# Altium project TIDA-01576_ADS8686S_ISO_Interface.PrjPcb (part 4 of 5)

## Sheet TIDA-01576_ADS8686S_ISO_Interface_Pg6-LevelShifters.SchDoc
size 431 x 279 mm; Date: Not shown in title block; ApprovedBy: Not shown in title block; CheckedBy: Not shown in title block; Author: Not shown in title block; CompanyName: Not shown in title block; Engineer: Not shown in title block; Organization: Not shown in title block; Address1: Not shown in title block; Address2: Not shown in title block; Address3: Not shown in title block; Address4: Not shown in title block; DocumentNumber: 1; Revision: Use project parameter SCH_Rev; SheetNumber: 6; SheetTotal: 8; PageSetup: Record=PageOptions|CenterHorizontal=True|CenterVertical=True|PrintScale=1.00|XCorrection=1.00|YCorrection=1.00|PrintKind=0|BorderSize=5000000|LeftOffset=0|BottomOffset=0|Orientation=2|PaperLength=1000|PaperWidth=1000|Scale=100|PaperSource=15|PrintQuality=600|MediaType=1|DitherType=10|PaperKind=Letter|PrintScaleMode=1; CurrentTime: Not shown in title block; CurrentDate: Not shown in title block; Time: Not shown in title block; DocumentFullPathAndName: Not shown in title block; DocumentName: Not shown in title block; ModifiedDate: Not shown in title block; ImagePath: Not shown in title block
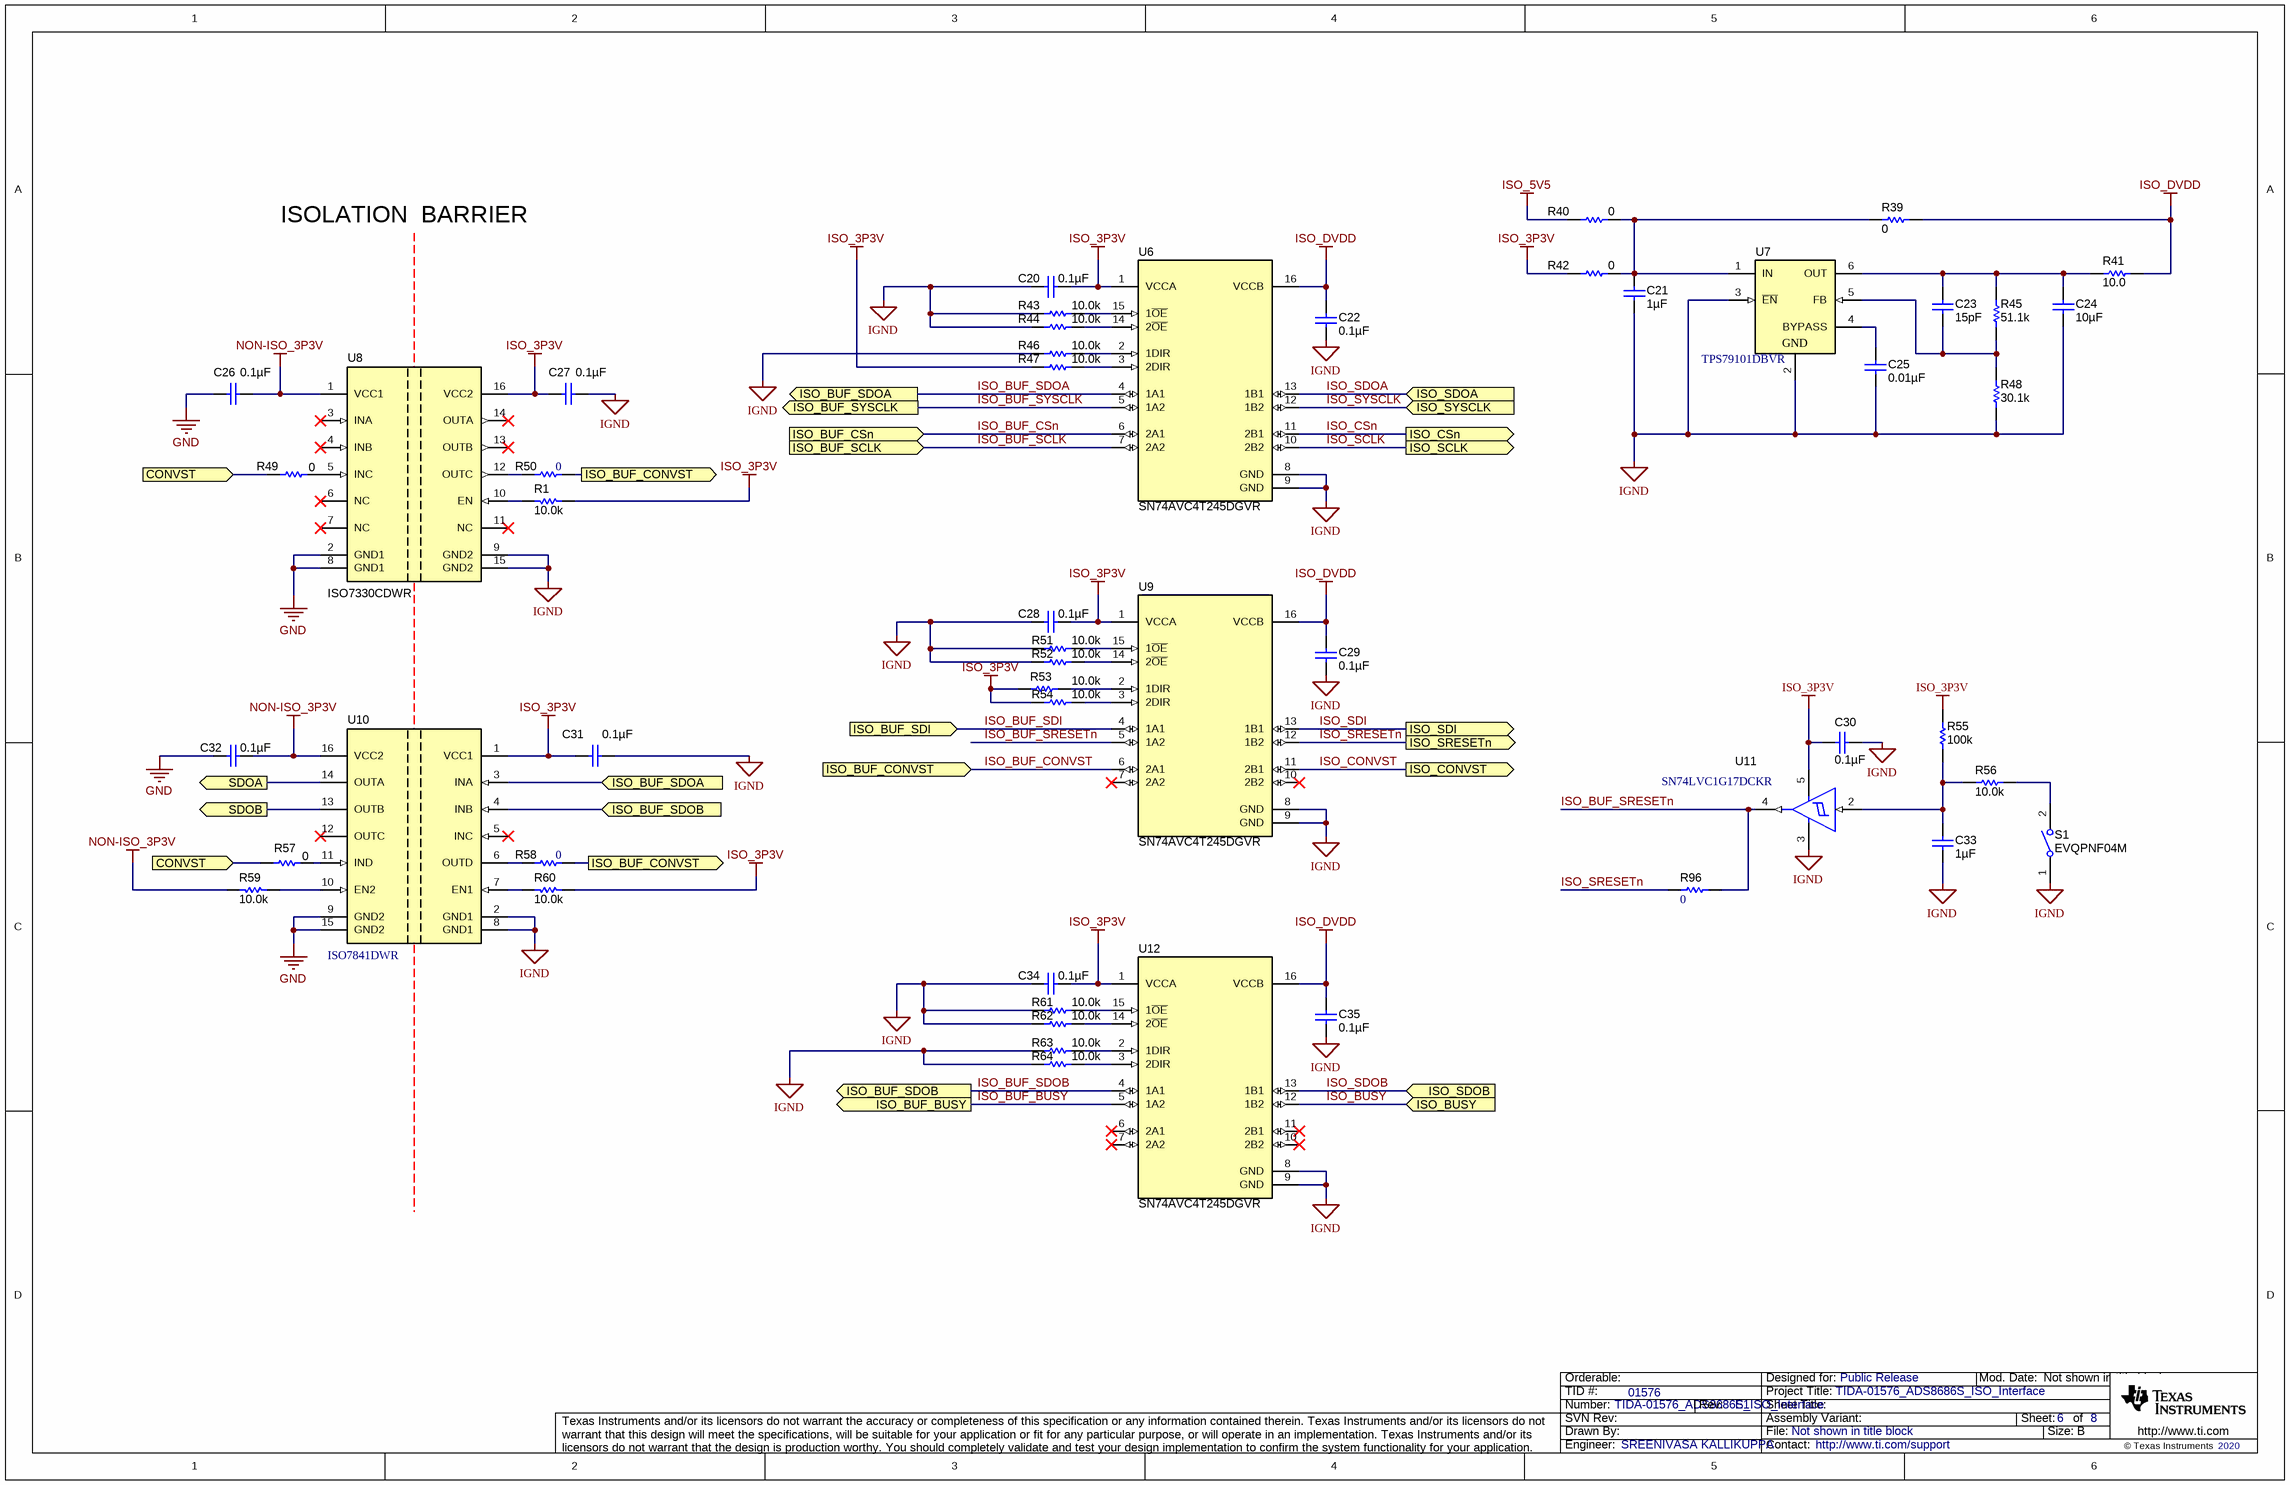
[diagram p5: TIDA-01576_ADS8686S_ISO_Interface_Pg6-LevelShifters.SchDoc]

### Parts
C20  ValueDisplayed: 0.1µF  [0402]  (hidden comment: GRM155R71C104KA88D)
C21  ValueDisplayed: 1µF  [0603]  (hidden comment: GRM188R71E105KA12D)
C22  ValueDisplayed: 0.1µF  [0402]  (hidden comment: GRM155R71C104KA88D)
C23  ValueDisplayed: 15pF  [0603]  (hidden comment: GRM1885C1H150JA01D)
C24  ValueDisplayed: 10µF  [0805_HV]  (hidden comment: CL21B106KOQNNNE)
C25  ValueDisplayed: 0.01µF  [0603]  (hidden comment: GRM188R71E103KA01D)
C26  ValueDisplayed: 0.1µF  [0402]  (hidden comment: GRM155R71C104KA88D)
C27  ValueDisplayed: 0.1µF  [0402]  (hidden comment: GRM155R71C104KA88D)
C28  ValueDisplayed: 0.1µF  [0402]  (hidden comment: GRM155R71C104KA88D)
C29  ValueDisplayed: 0.1µF  [0402]  (hidden comment: GRM155R71C104KA88D)
C30  ValueDisplayed: 0.1µF  [0402]  (hidden comment: GRM155R71C104KA88D)
C31  ValueDisplayed: 0.1µF  [0402]  (hidden comment: GRM155R71C104KA88D)
C32  ValueDisplayed: 0.1µF  [0402]  (hidden comment: GRM155R71C104KA88D)
C33  ValueDisplayed: 1µF  [0603]  (hidden comment: GRM188R71E105KA12D)
C34  ValueDisplayed: 0.1µF  [0402]  (hidden comment: GRM155R71C104KA88D)
C35  ValueDisplayed: 0.1µF  [0402]  (hidden comment: GRM155R71C104KA88D)
R1  ValueDisplayed: 10.0k  [0402]  (hidden comment: ERJ-2RKF1002X)
R39  ValueDisplayed: 0  [0603]  (hidden comment: CRCW06030000Z0EA)
R40  ValueDisplayed: 0  [0603]  (hidden comment: CRCW06030000Z0EA)
R41  ValueDisplayed: 10.0  [0603]  (hidden comment: CRT0603-BY-10R0ELF)
R42  ValueDisplayed: 0  [0603]  (hidden comment: CRCW06030000Z0EA)
R43  ValueDisplayed: 10.0k  [0402]  (hidden comment: ERJ-2RKF1002X)
R44  ValueDisplayed: 10.0k  [0402]  (hidden comment: ERJ-2RKF1002X)
R45  ValueDisplayed: 51.1k  [0603]  (hidden comment: CRCW060351K1FKEA)
R46  ValueDisplayed: 10.0k  [0402]  (hidden comment: ERJ-2RKF1002X)
R47  ValueDisplayed: 10.0k  [0402]  (hidden comment: ERJ-2RKF1002X)
R48  ValueDisplayed: 30.1k  [0603]  (hidden comment: CRCW060330K1FKEA)
R49  ValueDisplayed: 0  [0402]  (hidden comment: ERJ-2GE0R00X)
R50  ValueDisplayed: 0  [0402]  (hidden comment: ERJ-2GE0R00X)
R51  ValueDisplayed: 10.0k  [0402]  (hidden comment: ERJ-2RKF1002X)
R52  ValueDisplayed: 10.0k  [0402]  (hidden comment: ERJ-2RKF1002X)
R53  ValueDisplayed: 10.0k  [0402]  (hidden comment: ERJ-2RKF1002X)
R54  ValueDisplayed: 10.0k  [0402]  (hidden comment: ERJ-2RKF1002X)
R55  ValueDisplayed: 100k  [0402]  (hidden comment: CRCW0402100KFKED)
R56  ValueDisplayed: 10.0k  [0402]  (hidden comment: ERJ-2RKF1002X)
R57  ValueDisplayed: 0  [0402]  (hidden comment: ERJ-2GE0R00X)
R58  ValueDisplayed: 0  [0402]  (hidden comment: ERJ-2GE0R00X)
R59  ValueDisplayed: 10.0k  [0402]  (hidden comment: ERJ-2RKF1002X)
R60  ValueDisplayed: 10.0k  [0402]  (hidden comment: ERJ-2RKF1002X)
R61  ValueDisplayed: 10.0k  [0402]  (hidden comment: ERJ-2RKF1002X)
R62  ValueDisplayed: 10.0k  [0402]  (hidden comment: ERJ-2RKF1002X)
R63  ValueDisplayed: 10.0k  [0402]  (hidden comment: ERJ-2RKF1002X)
R64  ValueDisplayed: 10.0k  [0402]  (hidden comment: ERJ-2RKF1002X)
R96  ValueDisplayed: 0  [0603]  (hidden comment: CRCW06030000Z0EA)
S1  EVQPNF04M  [SW_EVQPNF04M]
U6  SN74AVC4T245DGVR  [DGV0016A_N]
U7  TPS79101DBVR  [DBV0006A_N]
U8  ISO7330CDWR  [DW0016B_HV]
U9  SN74AVC4T245DGVR  [DGV0016A_N]
U10  ISO7841DWR  [DW0016B_HV]
U11  SN74LVC1G17DCKR  [DCK0005A_L]
U12  SN74AVC4T245DGVR  [DGV0016A_N]

### Ports
CONVST (in), ISO_BUF_BUSY (out), ISO_BUF_CONVST (in), ISO_BUF_CONVST (out), ISO_BUF_CSn (in), ISO_BUF_SCLK (in), ISO_BUF_SDI (in), ISO_BUF_SDOA (in), ISO_BUF_SDOA (out), ISO_BUF_SDOB (in), ISO_BUF_SDOB (out), ISO_BUF_SYSCLK (out), ISO_BUSY (in), ISO_CONVST (out), ISO_CSn (out), ISO_SCLK (out), ISO_SDI (out), ISO_SDOA (in), ISO_SDOB (in), ISO_SRESETn (out), ISO_SYSCLK (in), SDOA (out), SDOB (out)

### Nets
GND: C26.1 C32.2 U8.2(GND1) U8.8(GND1) U10.9(GND2) U10.15(GND2)
IGND: C20.2 C21.1 C22.2 C24.2 C25.2 C27.2 C28.2 C29.2 C30.1 C31.1 C33.2 C34.2 C35.2 R43.1 R44.1 R46.2 R48.1 R51.1 R52.1 R61.1 R62.1 R63.1 R64.1 S1.1 U6.8(GND) U6.9(GND) U7.2(GND) U7.3(~{EN}) U8.9(GND2) U8.15(GND2) U9.8(GND) U9.9(GND) U10.2(GND1) U10.8(GND1) U11.3(GND) U12.8(GND) U12.9(GND)
ISO_3P3V: C20.1 C27.1 C28.1 C30.2 C31.2 C34.1 R1.1 R42.2 R47.2 R53.2 R54.1 R55.2 R60.1 U6.1(VCCA) U8.16(VCC2) U9.1(VCCA) U10.1(VCC1) U11.5(VCC) U12.1(VCCA)
ISO_5V5: R40.2
ISO_DVDD: C22.1 C29.1 C35.1 R39.1 R41.1 U6.16(VCCB) U9.16(VCCB) U12.16(VCCB)
NON-ISO_3P3V: C26.2 C32.1 R59.2 U8.1(VCC1) U10.16(VCC2)
CONVST: R49.1 R57.1 ; port CONVST
ISO_BUF_BUSY: U12.5(1A2) ; port ISO_BUF_BUSY
ISO_BUF_CONVST: R50.2 R58.2 U9.6(2A1) ; port ISO_BUF_CONVST
ISO_BUF_CSn: U6.6(2A1) ; port ISO_BUF_CSn
ISO_BUF_SCLK: U6.7(2A2) ; port ISO_BUF_SCLK
ISO_BUF_SDI: U9.4(1A1) ; port ISO_BUF_SDI
ISO_BUF_SDOA: U6.4(1A1) U10.3(INA) ; port ISO_BUF_SDOA
ISO_BUF_SDOB: U10.4(INB) U12.4(1A1) ; port ISO_BUF_SDOB
ISO_BUF_SRESETn: R96.1 U9.5(1A2) U11.4(Y)
ISO_BUF_SYSCLK: U6.5(1A2) ; port ISO_BUF_SYSCLK
ISO_BUSY: U12.12(1B2) ; port ISO_BUSY
ISO_CONVST: U9.11(2B1) ; port ISO_CONVST
ISO_CSn: U6.11(2B1) ; port ISO_CSn
ISO_SCLK: U6.10(2B2) ; port ISO_SCLK
ISO_SDI: U9.13(1B1) ; port ISO_SDI
ISO_SDOA: U6.13(1B1) ; port ISO_SDOA
ISO_SDOB: U12.13(1B1) ; port ISO_SDOB
ISO_SRESETn: R96.2 U9.12(1B2) ; port ISO_SRESETn
ISO_SYSCLK: U6.12(1B2) ; port ISO_SYSCLK
SDOA: U10.14(OUTA) ; port SDOA
SDOB: U10.13(OUTB) ; port SDOB
NetC21_2: C21.2 R39.2 R40.1 R42.1 U7.1(IN)
NetC23_1: C23.1 C24.1 R41.2 R45.2 U7.6(OUT)
NetC23_2: C23.2 R45.1 R48.2 U7.5(FB)
NetC25_1: C25.1 U7.4(BYPASS)
NetC33_1: C33.1 R55.1 R56.1 U11.2(A)
NetR1_2: R1.2 U8.10(EN)
NetR43_2: R43.2 U6.15(1~{OE})
NetR44_2: R44.2 U6.14(2~{OE})
NetR46_1: R46.1 U6.2(1DIR)
NetR47_1: R47.1 U6.3(2DIR)
NetR49_2: R49.2 U8.5(INC)
NetR50_1: R50.1 U8.12(OUTC)
NetR51_2: R51.2 U9.15(1~{OE})
NetR52_2: R52.2 U9.14(2~{OE})
NetR53_1: R53.1 U9.2(1DIR)
NetR54_2: R54.2 U9.3(2DIR)
NetR56_2: R56.2 S1.2
NetR57_2: R57.2 U10.11(IND)
NetR58_1: R58.1 U10.6(OUTD)
NetR59_1: R59.1 U10.10(EN2)
NetR60_2: R60.2 U10.7(EN1)
NetR61_2: R61.2 U12.15(1~{OE})
NetR62_2: R62.2 U12.14(2~{OE})
NetR63_2: R63.2 U12.2(1DIR)
NetR64_2: R64.2 U12.3(2DIR)

Not connected (* = marked no-connect by the designer): U8 3(INA)* 4(INB)* 6(NC)* 7(NC)* 11(NC)* 13(OUTB)* 14(OUTA)*; U9 7(2A2)* 10(2B2)*; U10 5(INC)* 12(OUTC)*; U12 6(2A1)* 7(2A2)* 10(2B2)* 11(2B1)*

### Notes on the sheet
- ISOLATION  BARRIER
- Drawn By:
- SVN Rev:
- Number:
- TID #:
- Orderable:
- Rev:
- Sheet Title:
- File:
- Project Title:
- Designed for:
- Assembly Variant:
- Mod. Date:
- Sheet:
- Size:
- of
- B
- http://www.ti.com
- Texas Instruments and/or its licensors do not warrant the accuracy or completeness of this specification or any information contained therein. Texas Instruments and/or its licensors do not warrant that this design will meet the specifications, will be suitable for your application or fit for any particular purpose, or will operate in an implementation. Texas Instruments and/or its licensors do not warrant that the design is production worthy. You should completely validate and test your design implementation to confirm the system functionality for your application.
- Engineer:
- Contact:
- © Texas Instruments

### Library data of the parts
C20 C22 C26-C29 C31 C32 C34 C35 = GRM155R71C104KA88D: CAP, CERM, 0.1 µF, 16 V, +/- 10%, X7R, 0402; Manufacturer: MuRata; Polarized: N; CompType: Capacitor; Value: 0.1uF; U/M: EA; Cap_F: 0.0000001; Tolerance_%: 10; Value1: Unknown; VDC_V: 16; Value2: 16V; TaMin_C: -55; TaMax_C: 125; SymbolVersion: 2008-07-09; PartNumber: GRM155R71C104KA88D; PackageReference: 0402; RoHS: Y; MountType: SMT; Technology: Ceramic; TempCo: X7R; Cap_Case: 0402; Published: 2008-06-19; Publisher: Texas Instruments; LatestRevisionDate: 2015-07-09; ComponentLink1Description: Datasheet link; ComponentLink1URL: http://search.murata.co.jp/Ceramy/PnsearchViewAction.do?HnOFG=ON&HnNFG=ON&SEL_CNT=50&sLang=en&sKey=GRM155R71C104KA88D&x=9&y=9&search=startwith; Supplier 1: Digi-Key; Supplier Part Number 1: 490-3261-1-ND; Supplier 2: Mouser; Supplier Part Number 2: 81-GRM155R71C104KA88; Supplier 3: Farnell; Supplier Part Number 3: 8819742
C21 C33 = GRM188R71E105KA12D: CAP, CERM, 1 µF, 25 V, +/- 10%, X7R, 0603; Manufacturer: MuRata; Polarized: N; CompType: Capacitor; Value: 1uF; U/M: EA; Cap_F: 0.000001; Tolerance_%: 10; Value1: Unknown; VDC_V: 25; Value2: 25V; TaMin_C: -55; TaMax_C: 125; AEC Category: Q200; SymbolVersion: 2008-07-09; PartNumber: GRM188R71E105KA12D; PackageReference: 0603; RoHS: Y; MountType: SMT; Technology: Ceramic; TempCo: X7R; Cap_Case: 0603; Published: 2008-06-19; Publisher: Texas Instruments; ComponentLink1Description: Datasheet link; ComponentLink1URL: http://search.murata.co.jp/Ceramy/PnsearchViewAction.do?HnOFG=ON&HnNFG=ON&SEL_CNT=50&sLang=en&sKey=GRM188R71E105KA12D&x=9&y=9&search=startwith; Supplier 1: Digi-Key; Supplier Part Number 1: 490-5307-1-ND; Supplier 2: Mouser; Supplier Part Number 2: 81-GRM188R71E105KA2D; Supplier 3: Farnell; Supplier Part Number 3: 1735540; AEC Qualified: ?
  C21: LatestRevisionDate: 2015-08-18
  C33: LatestRevisionDate: 2015-08-22
C23 = GRM1885C1H150JA01D: CAP, CERM, 15 pF, 50 V, +/- 5%, C0G/NP0, 0603; Manufacturer: MuRata; Polarized: N; CompType: Capacitor; Value: 15pF; U/M: EA; Cap_F: 0.000000000015; Tolerance_%: 5; Value1: Unknown; VDC_V: 50; Value2: 50V; TaMin_C: -55; TaMax_C: 125; SizeArea_mm2: 1.28; SizeAreaWB_mm2: 4.68; SizeX_mm: 1.6; SizeY_mm: 0.8; SizeZ_mm: 1; AEC Category: Q200; SymbolVersion: 2008-07-09; PartNumber: GRM1885C1H150JA01D; PackageReference: 0603; RoHS: Y; MountType: SMT; Technology: Ceramic; TempCo: C0G/NP0; Cap_Case: 0603; Published: 2008-06-19; Publisher: Texas Instruments; LatestRevisionDate: 2016-10-28; ComponentLink1Description: Datasheet link; ComponentLink1URL: http://search.murata.co.jp/Ceramy/PnsearchViewAction.do?HnOFG=ON&HnNFG=ON&SEL_CNT=50&sLang=en&sKey=GRM1885C1H150JA01D&x=9&y=9&search=startwith; Supplier 1: Digi-Key; Supplier Part Number 1: 490-1407-1-ND; Supplier 2: Mouser; Supplier Part Number 2: 81-GRM39C150J50; Supplier 3: Farnell; Supplier Part Number 3: 8819823; AEC Qualified: ?
C24 = CL21B106KOQNNNE: CAP, CERM, 10 µF, 16 V, +/- 10%, X7R, 0805; Manufacturer: Samsung Electro-Mechanics; Polarized: N; CompType: Capacitor; Value: 10uF; U/M: EA; Cap_F: 0.00001; Tolerance_%: 10; Value1: Unknown; VDC_V: 16; Value2: 16V; TaMin_C: -55; TaMax_C: 125; Cap_Case: 0805; SizeArea_mm2: 2.5; SizeAreaWB_mm2: 6.75; SizeX_mm: 2; SizeY_mm: 1.25; SizeZ_mm: 1.45; AEC Category: Q200; SymbolVersion: 2008-07-09; PartNumber: CL21B106KOQNNNE; PackageReference: 0805; RoHS: Y; MountType: SMT; Technology: Ceramic; TempCo: X7R; Published: 2008-06-19; Publisher: Texas Instruments; LatestRevisionDate: 2016-10-28; ComponentLink1Description: Datasheet link; ComponentLink1URL: http://www.samsungsem.com/servlet/FileDownload?type=spec&file=CL21B106KOQNNNE.pdf; AEC Qualified: ?
C25 = GRM188R71E103KA01D: CAP, CERM, 0.01 µF, 25 V, +/- 10%, X7R, 0603; Manufacturer: MuRata; Polarized: N; CompType: Capacitor; Value: 0.01uF; U/M: EA; Cap_F: 0.00000001; Tolerance_%: 10; Value1: Unknown; VDC_V: 25; Value2: 25V; TaMin_C: -55; TaMax_C: 125; SizeArea_mm2: 1.28; SizeAreaWB_mm2: 4.68; SizeX_mm: 1.6; SizeY_mm: 0.8; SizeZ_mm: 1; AEC Category: Q200; SymbolVersion: 2008-07-09; PartNumber: GRM188R71E103KA01D; PackageReference: 0603; RoHS: Y; MountType: SMT; Technology: Ceramic; TempCo: X7R; Cap_Case: 0603; Published: 2008-06-19; Publisher: Texas Instruments; LatestRevisionDate: 2016-10-28; ComponentLink1Description: Datasheet link; ComponentLink1URL: http://search.murata.co.jp/Ceramy/PnsearchViewAction.do?HnOFG=ON&HnNFG=ON&SEL_CNT=50&sLang=en&sKey=GRM188R71E103KA01D&x=9&y=9&search=startwith; Supplier 1: Digi-Key; Supplier Part Number 1: 490-1520-1-ND; Supplier 2: Mouser; Supplier Part Number 2: 81-GRM39X103K25; AEC Qualified: ?
C30 = GRM155R71C104KA88D: CAP, CERM, 0.1 µF, 16 V, +/- 10%, X7R, 0402; Manufacturer: MuRata; Polarized: N; CompType: Capacitor; Value: 0.1uF; U/M: EA; Cap_F: 0.0000001; Tolerance_%: 10; Value1: Unknown; VDC_V: 16; Value2: 16V; TaMin_C: -55; TaMax_C: 125; AEC Category: Q200; SymbolVersion: 2008-07-09; PartNumber: GRM155R71C104KA88D; RoHS: Y; MountType: SMT; Technology: Ceramic; TempCo: X7R; Cap_Case: 0402; Published: 2008-06-19; Publisher: Texas Instruments; LatestRevisionDate: 2015-08-22; ComponentLink1Description: Datasheet link; ComponentLink1URL: http://search.murata.co.jp/Ceramy/PnsearchViewAction.do?HnOFG=ON&HnNFG=ON&SEL_CNT=50&sLang=en&sKey=GRM155R71C104KA88D&x=9&y=9&search=startwith; Supplier 1: Digi-Key; Supplier Part Number 1: 490-3261-1-ND; Supplier 2: Mouser; Supplier Part Number 2: 81-GRM155R71C104KA88; Supplier 3: Farnell; Supplier Part Number 3: 8819742; AEC Qualified: ?; PackageReference: 0402
R1 R43 R44 R46 R47 R51-R54 R56 R59-R64 = ERJ-2RKF1002X: RES, 10.0 k, 1%, 0.1 W, 0402; Manufacturer: Panasonic; CompType: Resistor; Value: 10.0k; Res_ohm: 10000; Value_Code: 10k0; Tolerance_%: 1; Power_W: 0.1; Value2: 0.1W; VDC_V: 50; TempCo: 100 ppm/C; EIA_Code: E96; U/M: EA; AEC Category: Q200; SymbolVersion: 2009-05-29; PartNumber: ERJ-2RKF1002X; PackageReference: 0402; RoHS: Y; Value1: 1%; MountType: SMT; Technology: Thick Film; Published: 2008-06-26; Publisher: Texas Instruments; ComponentLink1Description: Datasheet link; ComponentLink1URL: http://industrial.panasonic.com/www-data/pdf/AOA0000/AOA0000CE2.pdf; Supplier 1: Digi-Key; Supplier Part Number 1: P10.0KLCT-ND; Supplier 2: Mouser; Supplier Part Number 2: 667-ERJ-2RKF1002X; AEC Qualified: ?
  R1 R43 R44 R46 R47 R51-R54 R59-R64: LatestRevisionDate: 2015-10-23
  R56: LatestRevisionDate: 2015-08-22
R39 R40 R42 = CRCW06030000Z0EA: RES, 0, 5%, 0.1 W, 0603; Manufacturer: Vishay-Dale; CompType: Resistor; Value: 0; Value_Code: 0000; Tolerance_%: 5; Power_W: 0.1; Value2: 0.1W; VDC_V: 75; TempCo: 200 ppm/C; EIA_Code: E24; U/M: EA; SymbolVersion: 2009-05-29; PartNumber: CRCW06030000Z0EA; PackageReference: 0603; RoHS: Y; Res_ohm: 0; Value1: 5%; MountType: SMT; Technology: Thick Film; Published: 2008-06-26; Publisher: Texas Instruments; ComponentLink1Description: Datasheet link; ComponentLink1URL: http://www.vishay.com/docs/20035/dcrcwe3.pdf; Supplier 1: Digi-Key; Supplier Part Number 1: 541-0.0GCT-ND; Supplier 2: Mouser; Supplier Part Number 2: 71-CRCW0603-0-E3; Supplier 3: Farnell; Supplier Part Number 3: 1469739
  R39: LatestRevisionDate: 2015-03-06
  R40 R42: LatestRevisionDate: 2014-10-21
R41 = CRT0603-BY-10R0ELF: RES, 10.0, 0.1%, 0.1 W, 0603; Manufacturer: Bourns; CompType: Resistor; Value: 10.0; Res_ohm: 10; Value_Code: 10R0; Tolerance_%: 0.1; Value2: 0.1W; TempCo: 25 ppm/C; SizeArea_mm2: 1.28; SizeX_mm: 1.6; SizeY_mm: 0.8; SizeZ_mm: 1; EIA_Code: E192; U/M: EA; AEC Category: Q200; AEC Qualified: N; SymbolVersion: 2009-05-29; PartNumber: CRT0603-BY-10R0ELF; PackageReference: 0603; RoHS: Y; Value1: 0.1%; Power_W: 0.1; MountType: SMT; Technology: Thin Film; Published: 2008-06-26; Publisher: Texas Instruments; LatestRevisionDate: 2016-10-13; ComponentLink1Description: Datasheet link; ComponentLink1URL: http://www.bourns.com/docs/Product-Datasheets/crt.pdf; Supplier 1: Digi-Key; Supplier Part Number 1: CRT0603-BY-10R0ELFCT-ND; Supplier 2: Mouser; Supplier Part Number 2: 652-CRT0603BY10R0ELF; Supplier 3: Farnell; Supplier Part Number 3: 2008309; AEC Grade: N/A
R45 = CRCW060351K1FKEA: RES, 51.1 k, 1%, 0.1 W, 0603; Manufacturer: Vishay-Dale; CompType: Resistor; Value: 51.1k; Res_ohm: 51100; Value_Code: 51k1; Tolerance_%: 1; Power_W: 0.1; Value2: 0.1W; VDC_V: 75; TempCo: 100 ppm/C; SizeArea_mm2: 1.28; SizeX_mm: 1.6; SizeY_mm: 0.8; EIA_Code: E96; U/M: EA; AEC Category: Q200; SymbolVersion: 2009-05-29; PartNumber: CRCW060351K1FKEA; PackageReference: 0603; RoHS: Y; Value1: 1%; MountType: SMT; Technology: Thick Film; SizeZ_mm: 1; Published: 2008-06-26; Publisher: Texas Instruments; LatestRevisionDate: 2016-10-13; ComponentLink1Description: Datasheet link; ComponentLink1URL: http://www.vishay.com/docs/20035/dcrcwe3.pdf; Supplier 1: Digi-Key; Supplier Part Number 1: 541-51.1KHCT-ND; Supplier 2: Mouser; Supplier Part Number 2: 71-CRCW0603-51.1K-E3; Supplier 3: Farnell; Supplier Part Number 3: 1469825; AEC Qualified: ?
R48 = CRCW060330K1FKEA: RES, 30.1 k, 1%, 0.1 W, 0603; Manufacturer: Vishay-Dale; CompType: Resistor; Value: 30.1k; Res_ohm: 30100; Value_Code: 30k1; Tolerance_%: 1; Power_W: 0.1; Value2: 0.1W; VDC_V: 75; TempCo: 100 ppm/C; SizeArea_mm2: 1.28; SizeX_mm: 1.6; SizeY_mm: 0.8; EIA_Code: E96; U/M: EA; AEC Category: Q200; SymbolVersion: 2009-05-29; PartNumber: CRCW060330K1FKEA; PackageReference: 0603; RoHS: Y; Value1: 1%; MountType: SMT; Technology: Thick Film; SizeZ_mm: 1; Published: 2008-06-26; Publisher: Texas Instruments; LatestRevisionDate: 2016-10-13; ComponentLink1Description: Datasheet link; ComponentLink1URL: http://www.vishay.com/docs/20035/dcrcwe3.pdf; Supplier 1: Digi-Key; Supplier Part Number 1: 541-30.1KHCT-ND; Supplier 2: Mouser; Supplier Part Number 2: 71-CRCW0603-30.1K-E3; Supplier 3: Farnell; Supplier Part Number 3: 1469798; AEC Qualified: ?
R49 R57 = ERJ-2GE0R00X: RES, 0, 5%, 0.063 W, 0402; Manufacturer: Panasonic; CompType: Resistor; Value: 0; Value_Code: 0000; Tolerance_%: 5; Power_W: 0.063; Value2: 0.063W; VDC_V: 50; TempCo: 600 ppm/C; EIA_Code: E24; U/M: EA; AEC Category: Q200; SymbolVersion: 2009-05-29; PartNumber: ERJ-2GE0R00X; PackageReference: 0402; RoHS: Y; Res_ohm: 0; Value1: 5%; MountType: SMT; Technology: Thick Film; Published: 2008-06-26; Publisher: Texas Instruments; LatestRevisionDate: 2015-10-23; ComponentLink1Description: Datasheet link; ComponentLink1URL: http://www.panasonic.com/industrial/components/pdf/AOA0000CE1.pdf; Supplier 1: Digi-Key; Supplier Part Number 1: P0.0JCT-ND; Supplier 2: Mouser; Supplier Part Number 2: 667-ERJ-2GE0R00X; Supplier 3: Farnell; Supplier Part Number 3: 2059190; AEC Qualified: ?
R50 R58 = CMP-0026992-3: RES, 0, 5%, 0.1 W, AEC-Q200 Grade 0, 0402; Manufacturer: Panasonic; Power_W: 100mW; TempCo: 600 ppm/C; Value_Code: 0000; Value: 0; EIA_Code: E24; SizeX_mm: 1; SizeY_mm: 0.5; SizeZ_mm: 0.6; Value2: 0.1W; AEC Qualified: Y; VDC_V: 50V; AEC Category: Q200; SizeAreaWB_mm2: 3; Supplier Part Number 2: 65T8307; Supplier 2: Newark; Supplier Part Number 3: 667-ERJ-2GE0R00X; Supplier 3: Mouser; RoHS: Y; Value1: 5%; MountType: SMT; Supplier 1: Digi-Key; PackageReference: 0402; Tolerance_%: 5%; Res_ohm: 0; SizeArea_mm2: 0.5; CompType: Resistor; PartNumber: ERJ-2GE0R00X; ComponentLink1Description: Datasheet link; Supplier Part Number 1: P0.0JCT-ND; Technology: Thick Film; ComponentLink1URL: https://industrial.panasonic.com/cdbs/www-data/pdf/RDA0000/AOA0000C301.pdf; AEC Grade: 0
R55 = CRCW0402100KFKED: RES, 100 k, 1%, 0.063 W, 0402; Manufacturer: Vishay-Dale; CompType: Resistor; Value: 100k; Res_ohm: 100000; Tolerance_%: 1; Power_W: 0.063; Value2: 0.063W; VDC_V: 50; TempCo: 100 ppm/C; EIA_Code: E96; U/M: EA; AEC Category: Q200; SymbolVersion: 2009-05-29; PartNumber: CRCW0402100KFKED; PackageReference: 0402; RoHS: Y; Value_Code: 100k; Value1: 1%; MountType: SMT; Technology: Thick Film; Published: 2008-06-26; Publisher: Texas Instruments; LatestRevisionDate: 2015-08-22; ComponentLink1Description: Datasheet link; ComponentLink1URL: http://www.vishay.com/docs/20035/dcrcwe3.pdf; Supplier 1: Digi-Key; Supplier Part Number 1: 541-100KLCT-ND; Supplier 2: Mouser; Supplier Part Number 2: 71-CRCW0402-100K-E3; Supplier 3: Farnell; Supplier Part Number 3: 1469671; AEC Qualified: ?
R96 = CMP-0025697-1: RES, 0, 5%, 0.1 W, 0603; Manufacturer: Vishay-Dale; Power_W: 100mW; TempCo: 200 ppm/C; Value_Code: 0000; U/M: EA; Value: 0; EIA_Code: E24; SizeX_mm: 1.6; SizeY_mm: 0.8; SizeZ_mm: 1; Value2: 0.1W; SizeArea_mm2: 1.28; VDC_V: 75V; AEC Category: Q200; ComponentLink1URL: http://www.vishay.com/docs/20035/dcrcwe3.pdf; Supplier Part Number 2: 52K8014; Publisher: Texas Instruments; Supplier 2: Newark; Supplier Part Number 3: 71-CRCW0603-0-E3; Supplier 3: Mouser; Published: 2008-06-26; RoHS: Y; Value1: 5%; MountType: SMT; Supplier 1: Digi-Key; PackageReference: 0603; Tolerance_%: 5%; Res_ohm: 0; CompType: Resistor; LatestRevisionDate: 2017-03-09; PartNumber: CRCW06030000Z0EA; AEC Qualified: ?; ComponentLink1Description: Datasheet link; Supplier Part Number 1: 541-0.0GCT-ND; Technology: Thick Film
S1 = EVQPNF04M: Switch, Tactile, SPST-NO, 0.05A, 12V, SMD; Manufacturer: Panasonic; SymbolCreator: a0799628; Circuit: SPST; VDC_V: 12; SwitchFunction: Off-Mom; PositionCount: 1; CurrentRating_mA: 50; SymbolVersion: 2013-06-26; PartNumber: EVQPNF04M; MountType: SMT; ComponentLink1Description: Datasheet URL; ComponentLink1URL: http://www.panasonic.net/id/ctlg/data/pdf/ATK0000/ATK0000PE76.pdf; RoHS: Y; Orientation: Top Actuated; CompType: Switch; PackageReference: SMD, 2-Leads, Body 6x4mm; Publisher: Texas Instruments; LatestRevisionDate: 2015-08-13; Supplier 1: Digi-Key; Supplier Part Number 1: P13597SCT-ND; Supplier 2: Mouser; Supplier Part Number 2: 667-EVQ-PNF04M; Supplier 3: Farnell; Supplier Part Number 3: 2079482
U6 U9 U12 = SN74AVC4T245DGVR: 4-Bit Dual-supply Bus Transceiver with Configurable Voltage Translation and 3-State Outputs, DGV0016A; Manufacturer: Texas Instruments; SymbolCreator: Altium; SizeArea_mm2: 40.96; SizeAreaWB_mm2: 70.56; SizeX_mm: 6.4; SizeZ_mm: 1.2; CompType: IC; U/M: EA; SymbolVerison: 2015-09-23; PartNumber: SN74AVC4T245DGVR; PackageReference: DGV0016A; PackageDescription: TVSOP-16; MountType: SMT; SizeY_mm: 6.4; ComponentLink1Description: Datasheet Link; ComponentLink1URL: http://www.ti.com/lit/ds/symlink/sn74avc4t245.pdf; RoHS: Y; Publisher: Texas Instruments; LatestRevisionDate: 2016-05-19; Alternate Manufacturer: Texas Instruments
U7 = TPS79101DBVR: Single Output High PSRR LDO, 100 mA, Adjustable 1.2 to 5.5 V Output, 2.7 to 5.5 V Input, 6-pin SOT-23 (DBV), -40 to 125 degC, Green (RoHS & no Sb/Br); Manufacturer: Texas Instruments; Alternate PartNumber: Equivalent; Accuracy(%): 2; Iout(Max)(A): 0.1; Iq(Typ)(mA): 0.2; SubFamily: Single Channel LDO; Vdo(Typ)(mV): 38; Vin(Max)(V): 5.5; Vin(Min)(V): 2.7; Vout Adj(Min)(V): 1.2; DatasheetVersion: SLVS325C; PackageVersion: 4073253-5/K; PackageReference: DBV0006A; PackageDescription: 6-Pin Plastic Small Outline, Body 1.60 Ã— 2.90 mm, Pitch 0.95 mm; Supplier 1: Digi-Key; Supplier Part Number 1: 296-11864-2-ND; Supplier 2: Digi-Key; Supplier Part Number 2: 296-11864-1-ND; Supplier 3: Digi-Key; Supplier Part Number 3: 296-11864-6-ND; Supplier 4: Farnell; Supplier Part Number 4: 1575748; Supplier 5: Newark; Supplier Part Number 5: 77C1342; Supplier 6: Mouser; Supplier Part Number 6: 595-TPS79101DBVR; Eco-Plan: Green (RoHS & no Sb/Br); Vout Adj(Max)(V): 5.5; MountType: SMT; Code_JEDEC: MO-178; PartNumber: TPS79101DBVR; ComponentLink1Description: Manufacturer URL; ComponentLink1URL: http://www.ti.com/; ComponentLink2Description: Datasheet; ComponentLink2URL: http://www.ti.com/general/docs/lit/getliterature.tsp?genericPartNumber=TPS79101&fileType=pdf; ComponentLink3Description: Package Specification; ComponentLink3URL: http://www.ti.com/litv/pdf/mpds026h; Alternate Manufacturer: Texas Instruments
U8 = ISO7330CDWR: Robust EMC, Low Power, Triple-Channel 3/0 Digital Isolator, Fail-Safe High, DW0016B (SOIC-16); Manufacturer: Texas Instruments; SymbolCreator: Altium; SizeArea_mm2: 107.12; SizeAreaWB_mm2: 152.52; SizeX_mm: 10.4; SizeY_mm: 10.3; SizeZ_mm: 2.65; CompType: IC; U/M: EA; SymbolVersion: 2016-3-6; PartNumber: ISO7330CDWR; Alternate PartNumber: ISO7330CDW; PackageReference: DW0016B; PackageDescription: SOIC-16; MountType: SMT; ComponentLink1Description: Datasheet Link; ComponentLink1URL: http://www.ti.com/lit/ds/symlink/iso7330c.pdf; RoHS: Y; Publisher: Texas Instruments; LatestRevisionDate: 2017-05-08; Alternate Manufacturer: Texas Instruments
U10 = CMP-0065838-4: High-Immunity, 5.7kVRMS Reinforced Quad-Channel 3/1 Digital Isolator, 100Mbps, DW0016B (SOIC-16); Alternate Manufacturer: Texas Instruments; SizeY_mm: 10.3; SizeX_mm: 10.4; SizeArea_mm2: 107.12; SizeAreaWB_mm2: 152.52; AEC Category: Q200; Rating: Catalog; CompType: IC; SizeZ_mm: 2.65; AEC Qualified: N; PackageDescription: SOIC-16; ComponentLink1Description: Datasheet Link; ComponentLink1URL: http://www.ti.com/lit/ds/symlink/iso7841.pdf; ComponentLink2URL: http://www.ti.com/product/iso7841; Operating Temperature Range: -55 to 125 C; ComponentLink3Description: Online Datasheet; ComponentLink3URL: http://www.ti.com/product/iso7841/datasheet; Alternate PartNumber: ISO7841DW; PackageReference: DW0016B; Manufacturer: Texas Instruments; MountType: SMT; RoHS: Y; PartNumber: ISO7841DWR; ComponentLink2Description: Product Folder
U11 = SN74LVC1G17DCKR: SINGLE SCHMITT-TRIGGER BUFFER, DCK0005A; Alternate PartNumber: SN74LVC1G17DCKT; Manufacturer: Texas Instruments; SymbolCreator: a0799628; CompType: IC; U/M: EA; SymbolVersion: 2014-01-24; PartNumber: SN74LVC1G17DCKR; PackageReference: DCK0005A; MountType: SMT; ComponentLink1Description: Datasheet Link; ComponentLink1URL: http://www.ti.com/lit/ds/symlink/sn74lvc1g17.pdf; RoHS: Y; Publisher: Texas Instruments; LatestRevisionDate: 2015-08-14; Alternate Manufacturer: Texas Instruments

## Sheet TIDA-01576_ADS8686S_ISO_Interface_Pg7-Connectors.SchDoc
size 431 x 279 mm; Date: Not shown in title block; ApprovedBy: Not shown in title block; CheckedBy: Not shown in title block; Author: Not shown in title block; CompanyName: Not shown in title block; Engineer: Not shown in title block; Organization: Not shown in title block; Address1: Not shown in title block; Address2: Not shown in title block; Address3: Not shown in title block; Address4: Not shown in title block; DocumentNumber: 1; Revision: Use project parameter SCH_Rev; SheetNumber: 7; SheetTotal: 8; PageSetup: Record=PageOptions|CenterHorizontal=True|CenterVertical=True|PrintScale=1.00|XCorrection=1.00|YCorrection=1.00|PrintKind=0|BorderSize=5000000|LeftOffset=0|BottomOffset=0|Orientation=2|PaperLength=1000|PaperWidth=1000|Scale=100|PaperSource=15|PrintQuality=600|MediaType=1|DitherType=10|PaperKind=Letter|PrintScaleMode=1; CurrentTime: Not shown in title block; CurrentDate: Not shown in title block; Time: Not shown in title block; DocumentFullPathAndName: Not shown in title block; DocumentName: Not shown in title block; ModifiedDate: Not shown in title block; ImagePath: Not shown in title block
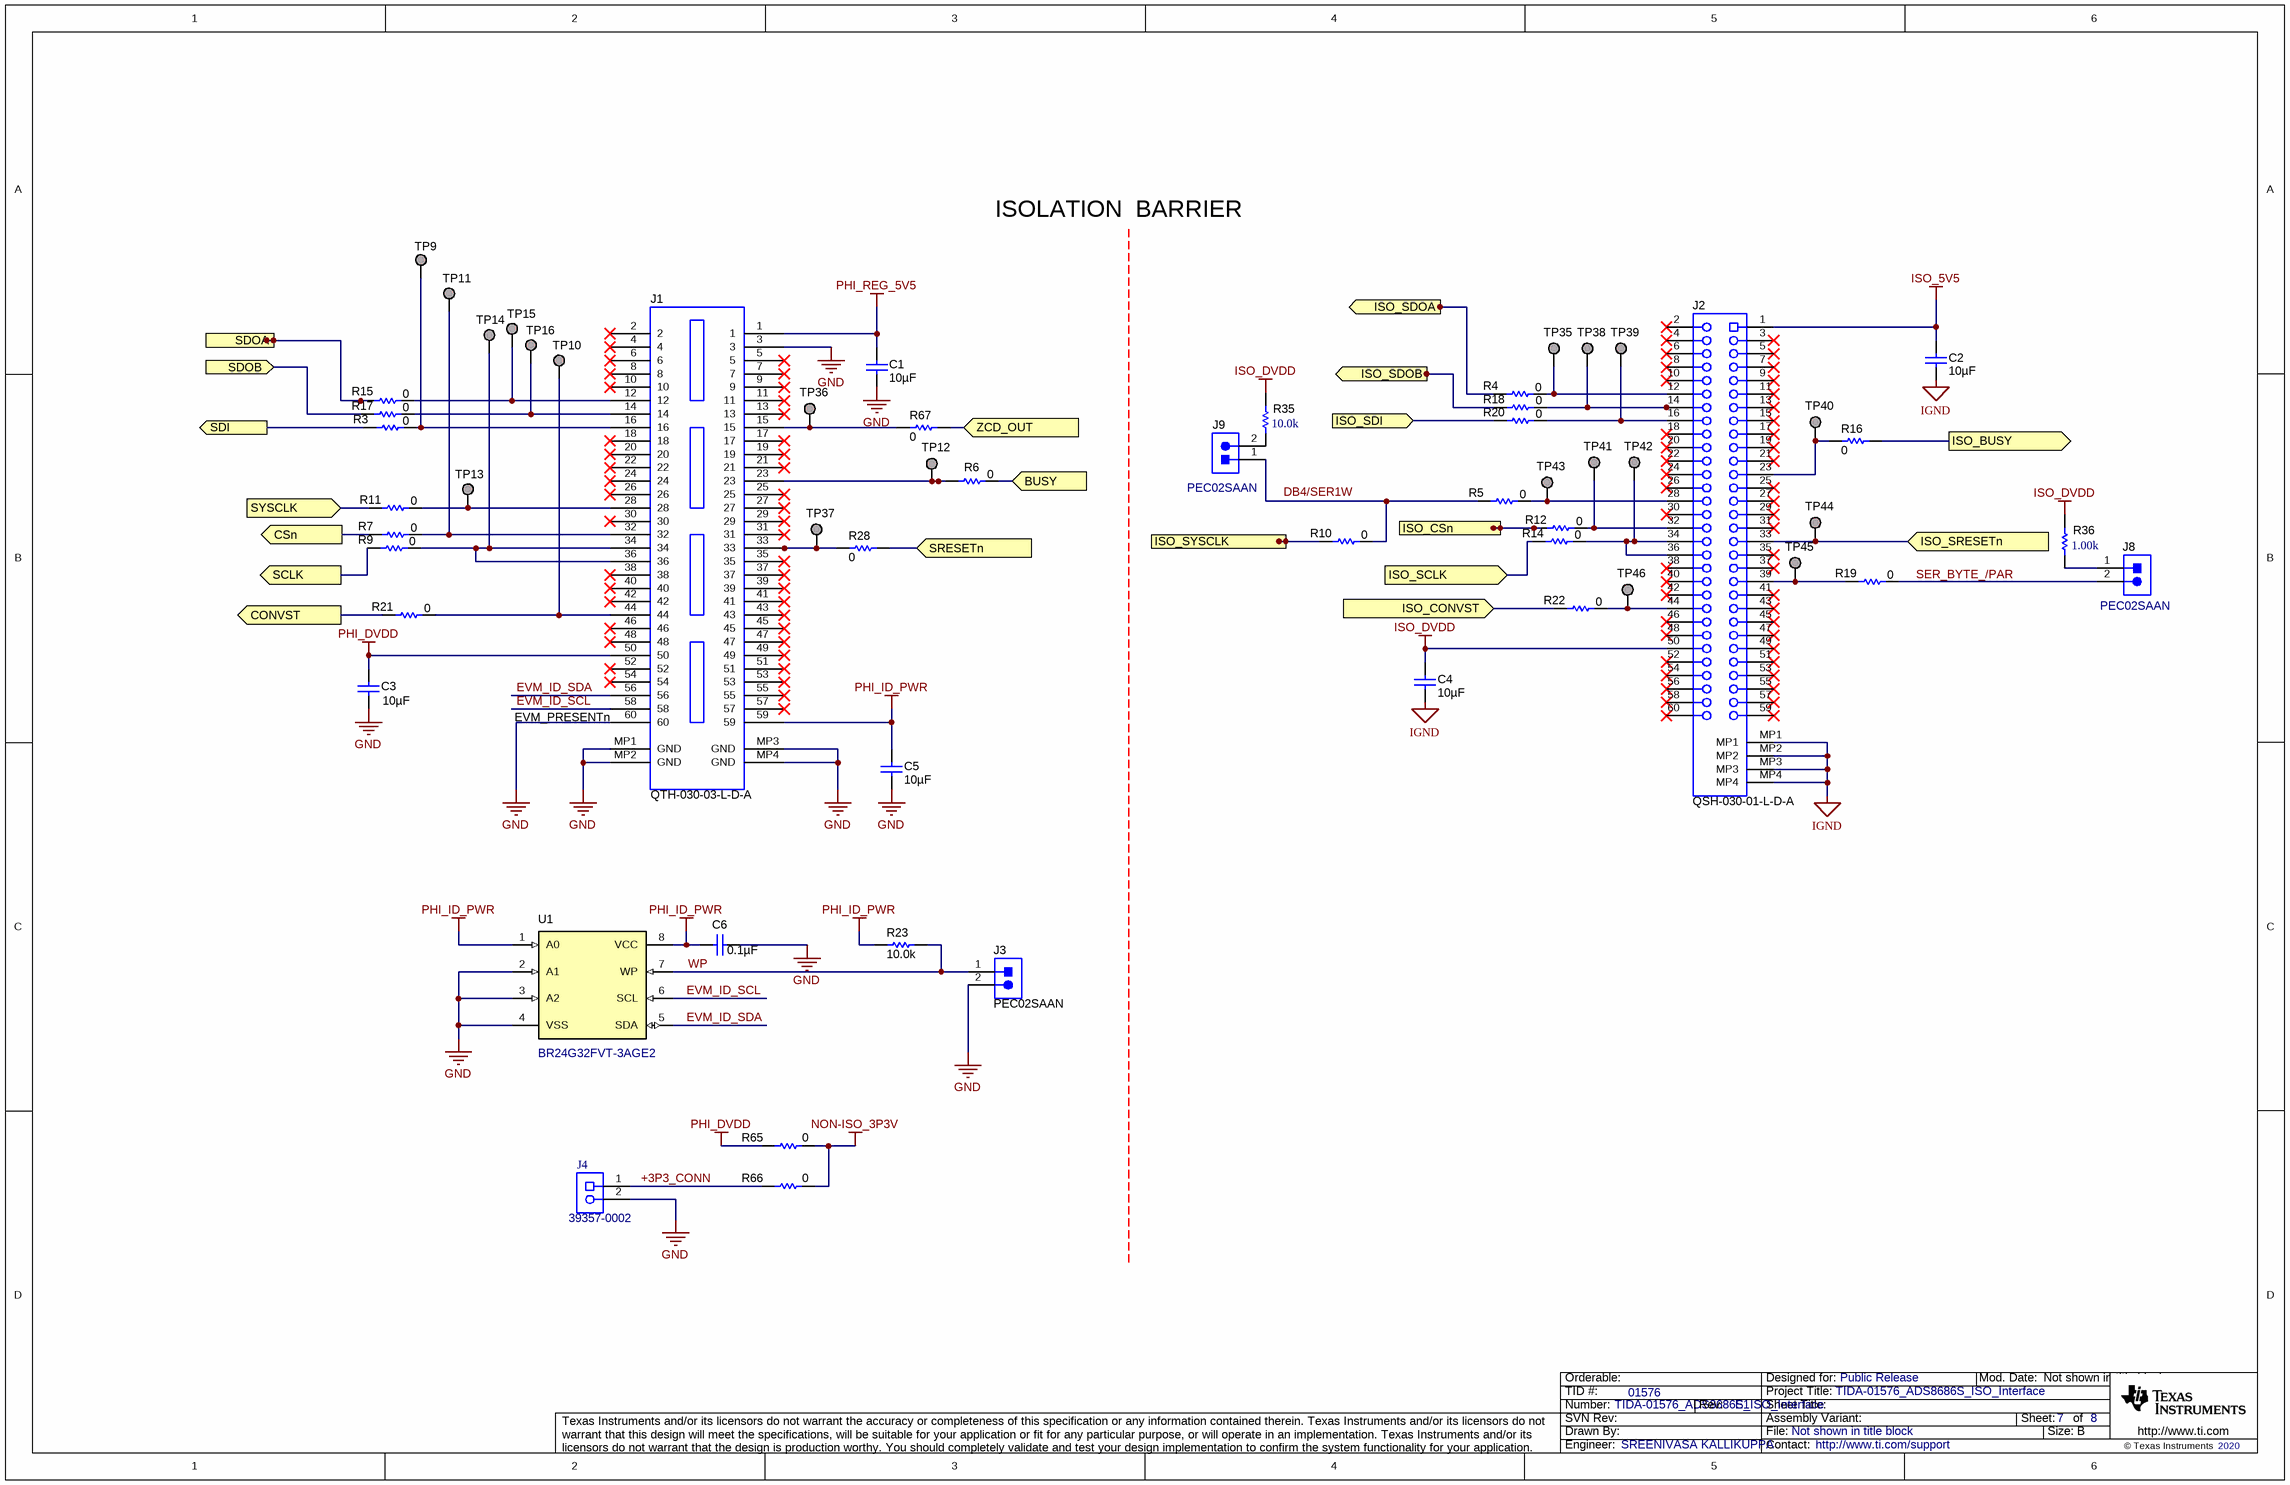
[diagram p6: TIDA-01576_ADS8686S_ISO_Interface_Pg7-Connectors.SchDoc]

### Parts
C1  ValueDisplayed: 10µF  [0805_HV]  (hidden comment: GRM21BR71A106KE51L)
C2  ValueDisplayed: 10µF  [0805_HV]  (hidden comment: GRM21BR71A106KE51L)
C3  ValueDisplayed: 10µF  [0805_HV]  (hidden comment: GRM21BR71A106KE51L)
C4  ValueDisplayed: 10µF  [0805_HV]  (hidden comment: GRM21BR71A106KE51L)
C5  ValueDisplayed: 10µF  [0805_HV]  (hidden comment: GRM21BR71A106KE51L)
C6  ValueDisplayed: 0.1µF  [0402]  (hidden comment: GRM155R71C104KA88D)
J1  QTH-030-03-L-D-A  [Samtec_QTH-030-01-x-D-A]
J2  QSH-030-01-L-D-A  [Samtec_QSH-030-01-X-D-A]
J3  PEC02SAAN  [CONN_PEC02SAAN]
J4  39357-0002  [MOLEX_39357-0002]
J8  PEC02SAAN  [CONN_PEC02SAAN]
J9  PEC02SAAN  [CONN_PEC02SAAN]
R3  ValueDisplayed: 0  [0402]  (hidden comment: ERJ-2GE0R00X)
R4  ValueDisplayed: 0  [0402]  (hidden comment: ERJ-2GE0R00X)
R5  ValueDisplayed: 0  [0402]  (hidden comment: ERJ-2GE0R00X)
R6  ValueDisplayed: 0  [0402]  (hidden comment: ERJ-2GE0R00X)
R7  ValueDisplayed: 0  [0402]  (hidden comment: ERJ-2GE0R00X)
R9  ValueDisplayed: 0  [0402]  (hidden comment: ERJ-2GE0R00X)
R10  ValueDisplayed: 0  [0402]  (hidden comment: ERJ-2GE0R00X)
R11  ValueDisplayed: 0  [0402]  (hidden comment: ERJ-2GE0R00X)
R12  ValueDisplayed: 0  [0402]  (hidden comment: ERJ-2GE0R00X)
R14  ValueDisplayed: 0  [0402]  (hidden comment: ERJ-2GE0R00X)
R15  ValueDisplayed: 0  [0402]  (hidden comment: ERJ-2GE0R00X)
R16  ValueDisplayed: 0  [0402]  (hidden comment: ERJ-2GE0R00X)
R17  ValueDisplayed: 0  [0402]  (hidden comment: ERJ-2GE0R00X)
R18  ValueDisplayed: 0  [0402]  (hidden comment: ERJ-2GE0R00X)
R19  ValueDisplayed: 0  [0402]  (hidden comment: ERJ-2GE0R00X)
R20  ValueDisplayed: 0  [0402]  (hidden comment: ERJ-2GE0R00X)
R21  ValueDisplayed: 0  [0402]  (hidden comment: ERJ-2GE0R00X)
R22  ValueDisplayed: 0  [0402]  (hidden comment: ERJ-2GE0R00X)
R23  ValueDisplayed: 10.0k  [0603]  (hidden comment: CRCW060310K0FKEA)
R28  ValueDisplayed: 0  [0402]  (hidden comment: ERJ-2GE0R00X)
R35  ValueDisplayed: 10.0k  [0402]  (hidden comment: ERJ-2RKF1002X)
R36  ValueDisplayed: 1.00k  [0402]  (hidden comment: ERJ-2RKF1001X)
R65  ValueDisplayed: 0  [0603]  (hidden comment: CRCW06030000Z0EA)
R66  ValueDisplayed: 0  [0603]  (hidden comment: CRCW06030000Z0EA)
R67  ValueDisplayed: 0  [0402]  (hidden comment: ERJ-2GE0R00X)
TP9  TP_H0.45P0.75  [TP_H045P075]  (value not drawn)
TP10  TP_H0.45P0.75  [TP_H045P075]  (value not drawn)
TP11  TP_H0.45P0.75  [TP_H045P075]  (value not drawn)
TP12  TP_H0.45P0.75  [TP_H045P075]  (value not drawn)
TP13  TP_H0.45P0.75  [TP_H045P075]  (value not drawn)
TP14  TP_H0.45P0.75  [TP_H045P075]  (value not drawn)
TP15  TP_H0.45P0.75  [TP_H045P075]  (value not drawn)
TP16  TP_H0.45P0.75  [TP_H045P075]  (value not drawn)
TP35  TP_H0.45P0.75  [TP_H045P075]  (value not drawn)
TP36  TP_H0.45P0.75  [TP_H045P075]  (value not drawn)
TP37  TP_H0.45P0.75  [TP_H045P075]  (value not drawn)
TP38  TP_H0.45P0.75  [TP_H045P075]  (value not drawn)
TP39  TP_H0.45P0.75  [TP_H045P075]  (value not drawn)
TP40  TP_H0.45P0.75  [TP_H045P075]  (value not drawn)
TP41  TP_H0.45P0.75  [TP_H045P075]  (value not drawn)
TP42  TP_H0.45P0.75  [TP_H045P075]  (value not drawn)
TP43  TP_H0.45P0.75  [TP_H045P075]  (value not drawn)
TP44  TP_H0.45P0.75  [TP_H045P075]  (value not drawn)
TP45  TP_H0.45P0.75  [TP_H045P075]  (value not drawn)
TP46  TP_H0.45P0.75  [TP_H045P075]  (value not drawn)
U1  BR24G32FVT-3AGE2  [TSOP65P640X120-8N]

### Ports
BUSY (in), CONVST (out), CSn (out), ISO_BUSY (out), ISO_CONVST (in), ISO_CSn (in), ISO_SCLK (in), ISO_SDI (in), ISO_SDOA (out), ISO_SDOB (out), ISO_SRESETn (in), ISO_SYSCLK (out), SCLK (out), SDI (out), SDOA (in), SDOB (in), SRESETn (in), SYSCLK (in), ZCD_OUT (in)

### Nets
GND: C1.2 C3.2 C5.2 C6.1 J1.3 J1.60 J1.MP1(GND) J1.MP2(GND) J1.MP3(GND) J1.MP4(GND) J3.2 J4.2 U1.2(A1) U1.3(A2) U1.4(VSS)
IGND: C2.2 C4.2 J2.MP1 J2.MP2 J2.MP3 J2.MP4
ISO_5V5: C2.1 J2.1
ISO_DVDD: C4.1 J2.50 R35.2 R36.2
NON-ISO_3P3V: R65.1 R66.1
PHI_DVDD: C3.1 J1.50 R65.2
PHI_ID_PWR: C5.1 C6.2 J1.59 R23.2 U1.1(A0) U1.8(VCC)
PHI_REG_5V5: C1.1 J1.1
+3P3_CONN: J4.1 R66.2
BUSY: R6.2 ; port BUSY
CONVST: R21.1 ; port CONVST
CSn: R7.1 ; port CSn
EVM_ID_SCL: J1.58 U1.6(SCL)
EVM_ID_SDA: J1.56 U1.5(SDA)
ISO_BUSY: R16.1 ; port ISO_BUSY
ISO_CONVST: R22.1 ; port ISO_CONVST
ISO_CSn: R12.1 ; port ISO_CSn
ISO_SCLK: R14.1 ; port ISO_SCLK
ISO_SDI: R20.1 ; port ISO_SDI
ISO_SDOA: R4.1 ; port ISO_SDOA
ISO_SDOB: R18.1 ; port ISO_SDOB
ISO_SRESETn: J2.33 TP44.1 ; port ISO_SRESETn
ISO_SYSCLK: R10.1 ; port ISO_SYSCLK
SCLK: R9.1 ; port SCLK
SDI: R3.1 ; port SDI
SDOA: R15.1 ; port SDOA
SDOB: R17.1 ; port SDOB
SRESETn: R28.1 ; port SRESETn
SYSCLK: R11.1 ; port SYSCLK
WP: J3.1 R23.1 U1.7(WP)
ZCD_OUT: R67.1 ; port ZCD_OUT
NetJ1_12: J1.12 R15.2 TP15.1
NetJ1_14: J1.14 R17.2 TP16.1
NetJ1_15: J1.15 R67.2 TP36.1
NetJ1_16: J1.16 R3.2 TP9.1
NetJ1_23: J1.23 R6.1 TP12.1
NetJ1_28: J1.28 R11.2 TP13.1
NetJ1_32: J1.32 R7.2 TP11.1
NetJ1_33: J1.33 R28.2 TP37.1
NetJ1_34: J1.34 J1.36 R9.2 TP14.1
NetJ1_44: J1.44 R21.2 TP10.1
NetJ2_12: J2.12 R4.2 TP35.1
NetJ2_14: J2.14 R18.2 TP38.1
NetJ2_16: J2.16 R20.2 TP39.1
NetJ2_23: J2.23 R16.2 TP40.1
NetJ2_28: J2.28 R5.2 TP43.1
NetJ2_32: J2.32 R12.2 TP41.1
NetJ2_34: J2.34 J2.36 R14.2 TP42.1
NetJ2_39: J2.39 R19.1 TP45.1
NetJ2_44: J2.44 R22.2 TP46.1
NetJ8_1: J8.1 R36.1
NetJ8_2: J8.2 R19.2
NetJ9_1: J9.1 R5.1 R10.2
NetJ9_2: J9.2 R35.1

Not connected (* = marked no-connect by the designer): J1 2* 4* 5* 6* 7* 8* 9* 10* 11* 13* 17* 18* 19* 20* 21* 22* 24* 25* 26* 27* 29* 30* 31* 35* 37* 38* 39* 40* 41* 42* 43* 45* 46* 47* 48* 49* 51* 52* 53* 54* 55* 57*; J2 2* 3* 4* 5* 6* 7* 8* 9* 10* 11* 13* 15* 17* 18* 19* 20* 21* 22* 24* 25* 26* 27* 29* 30* 31* 35* 37* 38* 40* 41* 42* 43* 45* 46* 47* 48* 49* 51* 52* 53* 54* 55* 56* 57* 58* 59* 60*

### Notes on the sheet
- ISOLATION  BARRIER
- SDOA/B SEL
- (near J8) SERIAL SEL
- (near J1) EVM_PRESENTn
- Labels drawn without touching a wire or pin: DB4/SER1W, SER_BYTE_/PAR
- Drawn By:
- SVN Rev:
- Number:
- TID #:
- Orderable:
- Rev:
- Sheet Title:
- File:
- Project Title:
- Designed for:
- Assembly Variant:
- Mod. Date:
- Sheet:
- Size:
- of
- B
- http://www.ti.com
- Texas Instruments and/or its licensors do not warrant the accuracy or completeness of this specification or any information contained therein. Texas Instruments and/or its licensors do not warrant that this design will meet the specifications, will be suitable for your application or fit for any particular purpose, or will operate in an implementation. Texas Instruments and/or its licensors do not warrant that the design is production worthy. You should completely validate and test your design implementation to confirm the system functionality for your application.
- Engineer:
- Contact:
- © Texas Instruments

### Library data of the parts
C1-C5 = GRM21BR71A106KE51L: CAP, CERM, 10 µF, 10 V, +/- 10%, X7R, 0805; Manufacturer: MuRata; Polarized: N; CompType: Capacitor; Value: 10uF; U/M: EA; Cap_F: 0.00001; Tolerance_%: 10; ESR_ohm: 0.003; Value1: 0.003 ohm; Value2: 10V; TaMin_C: -55; TaMax_C: 125; Cap_Case: 0805; AEC Category: Q200; SymbolVersion: 2008-07-09; PartNumber: GRM21BR71A106KE51L; PackageReference: 0805; RoHS: Y; VDC_V: 10; MountType: SMT; Technology: Ceramic; TempCo: X7R; Published: 2008-06-19; Publisher: Texas Instruments; LatestRevisionDate: 2015-11-13; ComponentLink1Description: Datasheet link; ComponentLink1URL: http://search.murata.co.jp/Ceramy/PnsearchViewAction.do?HnOFG=ON&HnNFG=ON&SEL_CNT=50&sLang=en&sKey=GRM21BR71A106KE51L&x=9&y=9&search=startwith; Supplier 1: Digi-Key; Supplier Part Number 1: 490-3905-1-ND; Supplier 2: Mouser; Supplier Part Number 2: 81-GRM21BR71A106KE51; Supplier 3: Farnell; Supplier Part Number 3: 1828828; AEC Qualified: ?
C6 = GRM155R71C104KA88D: as C20 on sheet TIDA-01576_ADS8686S_ISO_Interface_Pg6-LevelShifters; SymbolVersion: 2008-07-09; PartNumber: GRM155R71C104KA88D; PackageReference: 0402; RoHS: Y; MountType: SMT; Technology: Ceramic; TempCo: X7R; Cap_Case: 0402; Published: 2008-06-19; Publisher: Texas Instruments; LatestRevisionDate: 2015-07-09; ComponentLink1Description: Datasheet link; ComponentLink1URL: http://search.murata.co.jp/Ceramy/PnsearchViewAction.do?HnOFG=ON&HnNFG=ON&SEL_CNT=50&sLang=en&sKey=GRM155R71C104KA88D&x=9&y=9&search=startwith; Supplier 1: Digi-Key; Supplier Part Number 1: 490-3261-1-ND; Supplier 2: Mouser; Supplier Part Number 2: 81-GRM155R71C104KA88; Supplier 3: Farnell; Supplier Part Number 3: 8819742
J1 = QTH-030-01-L-D-A: Header(Shrouded), 19.7mil, 30x2, Gold, SMT; Manufacturer: Samtec; SymbolCreator: Altium; U/M: EA; SymbolVersion: 2015-05-13; PartNumber: QTH-030-03-L-D-A; PackageReference: Header (Shrouded), 19.7mil, 30x2, SMT; CompType: Header; RoHS: Y; MountType: SMT; ComponentLink1Description: Datasheet Link; ComponentLink1URL: https://www.samtec.com/ftppub/cpdf/QTH-XXX-XX-X-D-XXX-MKT.pdf; Publisher: Texas Instruments; LatestRevisionDate: 2015-07-08; Supplier 1: Digi-Key; Supplier Part Number 1: SAM8185-ND
J2 = QSH-030-01-L-D-A: Receptacle, 0.5 mm, 30x2, Gold, TH; Manufacturer: Samtec; SymbolCreator: Altium; Pitch_mm: 0.5; Gender: Female; Shrouded: N; Row_Count: 2; RowSpacing_mm: 5.73; SymbolVersion: 2015-03-06; PartNumber: QSH-030-01-L-D-A; PackageReference: Receptacle, 0.5 mm, 30x2, TH; CompType: Receptacle; RoHS: Y; MountType: SMT; ComponentLink1Description: Datasheet URL; ComponentLink1URL: http://www.samtec.com/ftppub/cpdf/QSH-XXX-01-X-D-XX-MKT.pdf; Orientation: Vertical; PinCount: 60; ContactFinish: Gold; Color: Black; Publisher: Texas Instruments; LatestRevisionDate: 2017-04-12; Supplier 1: Digi-Key; Supplier Part Number 1: SAM8180-ND; Supplier 2: Newark; Supplier Part Number 2: 19M9181; Supplier 3: Farnell; Supplier Part Number 3: 1667876
J3 = PEC02SAAN: Header, 100mil, 2x1, Tin, TH; Manufacturer: Sullins Connector Solutions; SymbolCreator: a0412235; Pitch_mm: 2.54; Gender: Male; Shrouded: N; Row_Count: 1; Current_A: 3; Voltage_V: 1800; Cert_UL: Y; Green_Lifecycle: Not Set; Green_REACh: Incomplete; SymbolVersion: 2013-10-31; PartNumber: PEC02SAAN; PackageReference: Header, 2 PIN, 100mil, Tin; ClassName: Header; CompType: Header; RoHS: Y; MountType: TH; ComponentLink1Description: Datasheet URL; ComponentLink1URL: http://www.sullinscorp.com/catalogs/77_PAGE108-109_.100_MALE_HDR.pdf; Orientation: Vertical; PinCount: 2; ContactFinish: Tin; Color: Black; Publisher: Texas Instruments; LatestRevisionDate: 2017-05-15; Supplier 1: Digi-Key; Supplier Part Number 1: S1012E-02-ND; Green_EU RoHS: Incomplete; Green_EU RoHS-2: Incomplete
J4 = CMP-0055341-1: Terminal Block, 3.5 mm, 2x1, Tin, TH; Manufacturer: Molex; CNHeader: FALSE; Green_Lifecycle: Not Set; Green_REACh: Incomplete; CT: TRUE; ComponentLink1URL: http://www.molex.com/pdm_docs/sd/393570002_sd.pdf; Supplier Part Number 2: 72K2104; Publisher: Texas Instruments; Supplier 2: Newark; Supplier Part Number 3: 538-39357-0002; Supplier 3: Mouser; RoHS: Y; MountType: TH; Green_EU RoHS-2: Incomplete; Supplier 1: Digi-Key; Green_EU RoHS: Incomplete; PackageReference: Terminal Block, 3.5 mm, 2x1, TH; CompType: Terminal Block; LatestRevisionDate: 26/05/2017; PartNumber: 39357-0002; ComponentLink1Description: Datasheet URL; Supplier Part Number 1: WM7877-ND
J8 J9 = CMP-0002337-1: Header, 100mil, 2x1, Tin, TH; Manufacturer: Sullins Connector Solutions; CNHeader: TRUE; Current_A: 3A; Green_Lifecycle: Not Set; Shrouded: N; Gender: Male; Green_REACh: Incomplete; Voltage_V: 1.8kV; Row_Count: 1; Pitch_mm: 2.54; CT: FALSE; Cert_UL: Y; ComponentLink1URL: http://www.sullinscorp.com/catalogs/77_PAGE108-109_.100_MALE_HDR.pdf; ClassName: Header; Publisher: Texas Instruments; Color: Black; RoHS: Y; MountType: TH; Green_EU RoHS-2: Incomplete; Supplier 1: Digi-Key; Green_EU RoHS: Incomplete; PackageReference: Header, 2 PIN, 100mil, Tin; PinCount: 2; CompType: Header; LatestRevisionDate: 26/05/2017; PartNumber: PEC02SAAN; Orientation: Vertical; ComponentLink1Description: Datasheet URL; Supplier Part Number 1: S1012E-02-ND; ContactFinish: Tin
R3-R7 R9-R12 R14-R22 R28 R67 = ERJ-2GE0R00X: as R49 on sheet TIDA-01576_ADS8686S_ISO_Interface_Pg6-LevelShifters; SymbolVersion: 2009-05-29; PartNumber: ERJ-2GE0R00X; PackageReference: 0402; RoHS: Y; Res_ohm: 0; Value1: 5%; MountType: SMT; Technology: Thick Film; Published: 2008-06-26; Publisher: Texas Instruments; LatestRevisionDate: 2015-10-23; ComponentLink1Description: Datasheet link; ComponentLink1URL: http://www.panasonic.com/industrial/components/pdf/AOA0000CE1.pdf; Supplier 1: Digi-Key; Supplier Part Number 1: P0.0JCT-ND; Supplier 2: Mouser; Supplier Part Number 2: 667-ERJ-2GE0R00X; Supplier 3: Farnell; Supplier Part Number 3: 2059190; AEC Qualified: ?
R23 = CRCW060310K0FKEA: RES, 10.0 k, 1%, 0.1 W, 0603; Manufacturer: Vishay-Dale; CompType: Resistor; Value: 10.0k; Res_ohm: 10000; Value_Code: 10k0; Tolerance_%: 1; Power_W: 0.1; Value2: 0.1W; VDC_V: 75; TempCo: 100 ppm/C; EIA_Code: E96; U/M: EA; SymbolVersion: 2009-05-29; PartNumber: CRCW060310K0FKEA; PackageReference: 0603; RoHS: Y; Value1: 1%; MountType: SMT; Technology: Thick Film; Published: 2008-06-26; Publisher: Texas Instruments; LatestRevisionDate: 2015-06-13; ComponentLink1Description: Datasheet link; ComponentLink1URL: http://www.vishay.com/docs/20035/dcrcwe3.pdf; Supplier 1: Digi-Key; Supplier Part Number 1: 541-10.0KHCT-ND; Supplier 2: Mouser; Supplier Part Number 2: 71-CRCW0603-10K-E3; Supplier 3: Farnell; Supplier Part Number 3: 1469748
R35 = CMP-0026658-1: RES, 10.0 k, 1%, 0.1 W, 0402; Manufacturer: Panasonic; Power_W: 100mW; TempCo: 100 ppm/C; Value_Code: 10k0; U/M: EA; Value: 10.0k; EIA_Code: E96; Res_ohm: 10k; SizeX_mm: 1; SizeY_mm: 0.5; SizeZ_mm: 0.6; Value2: 0.1W; VDC_V: 50V; AEC Category: Q200; ComponentLink1URL: http://industrial.panasonic.com/www-data/pdf/AOA0000/AOA0000CE2.pdf; Supplier Part Number 2: 90W2949; Publisher: Texas Instruments; Supplier 2: Newark; Supplier Part Number 3: 667-ERJ-2RKF1002X; Supplier 3: Mouser; Published: 2008-06-26; RoHS: Y; Value1: 1%; MountType: SMT; Supplier 1: Digi-Key; PackageReference: 0402; Tolerance_%: 1%; SizeArea_mm2: 0.5; CompType: Resistor; LatestRevisionDate: 2017-03-09; PartNumber: ERJ-2RKF1002X; AEC Qualified: ?; ComponentLink1Description: Datasheet link; Supplier Part Number 1: P10.0KLCT-ND; Technology: Thick Film
R36 = CMP-0026657-1: RES, 1.00 k, 1%, 0.1 W, 0402; Manufacturer: Panasonic; Power_W: 100mW; TempCo: 100 ppm/C; Value_Code: 1k00; U/M: EA; Value: 1.00k; EIA_Code: E96; Res_ohm: 1k; SizeX_mm: 1; SizeY_mm: 0.5; SizeZ_mm: 0.6; Value2: 0.1W; VDC_V: 50V; AEC Category: Q200; ComponentLink1URL: http://industrial.panasonic.com/www-data/pdf/AOA0000/AOA0000CE2.pdf; Supplier Part Number 2: 64R5247; Publisher: Texas Instruments; Supplier 2: Newark; Supplier Part Number 3: 667-ERJ-2RKF1001X; Supplier 3: Mouser; Published: 2008-06-26; RoHS: Y; Value1: 1%; MountType: SMT; Supplier 1: Digi-Key; PackageReference: 0402; Tolerance_%: 1%; SizeArea_mm2: 0.5; CompType: Resistor; LatestRevisionDate: 2017-03-09; PartNumber: ERJ-2RKF1001X; AEC Qualified: ?; ComponentLink1Description: Datasheet link; Supplier Part Number 1: P1.00KLCT-ND; Technology: Thick Film
R65 R66 = CRCW06030000Z0EA: as R39 on sheet TIDA-01576_ADS8686S_ISO_Interface_Pg6-LevelShifters; SymbolVersion: 2009-05-29; PartNumber: CRCW06030000Z0EA; PackageReference: 0603; RoHS: Y; Res_ohm: 0; Value1: 5%; MountType: SMT; Technology: Thick Film; Published: 2008-06-26; Publisher: Texas Instruments; LatestRevisionDate: 2014-10-21; ComponentLink1Description: Datasheet link; ComponentLink1URL: http://www.vishay.com/docs/20035/dcrcwe3.pdf; Supplier 1: Digi-Key; Supplier Part Number 1: 541-0.0GCT-ND; Supplier 2: Mouser; Supplier Part Number 2: 71-CRCW0603-0-E3; Supplier 3: Farnell; Supplier Part Number 3: 1469739
TP9-TP16 TP35-TP46 = TP_H0.45P0.75: Testpoint; Manufacturer: Texas Instruments; SymbolCreator: a0412235; CompType: Pad; SymbolVersion: 2017-04-26; PartNumber: TP_H0.45P0.75; PackageReference: Test Point, 0.45mm hole size; MountType: TH; ComponentLink1Description: Datasheet Link; ComponentLink1URL: https://sps06.itg.ti.com/sites/KMS/crossdivteams/altium/docs/ComponentDatasheets/testpin with 750um Padsice and 450um drillhole.pdf; Publisher: Texas Instruments; LatestRevisionDate: 2017-05-23
U1 = CMP-0004843-1: I2C BUS EEPROM (2-Wire), TSSOP-B8; Manufacturer: Rohm; ComponentLink1URL: http://rohmfs.rohm.com/en/products/databook/datasheet/ic/memory/eeprom/br24g32-3-e.pdf; Publisher: Texas Instruments; Supplier Part Number 2: 755-BR24G32FVT-3AGE2; Supplier 1: Digi-Key; PackageReference: TSSOP-8; LatestRevisionDate: 09/03/2017; RoHS: Y; Supplier Part Number 1: BR24G32FVT-3AG2CT-ND; MountType: SMT; Supplier 2: Mouser; PartNumber: BR24G32FVT-3AGE2; ComponentLink1Description: Datasheet URL